# Altium project TSE_mother_board.PrjPcb
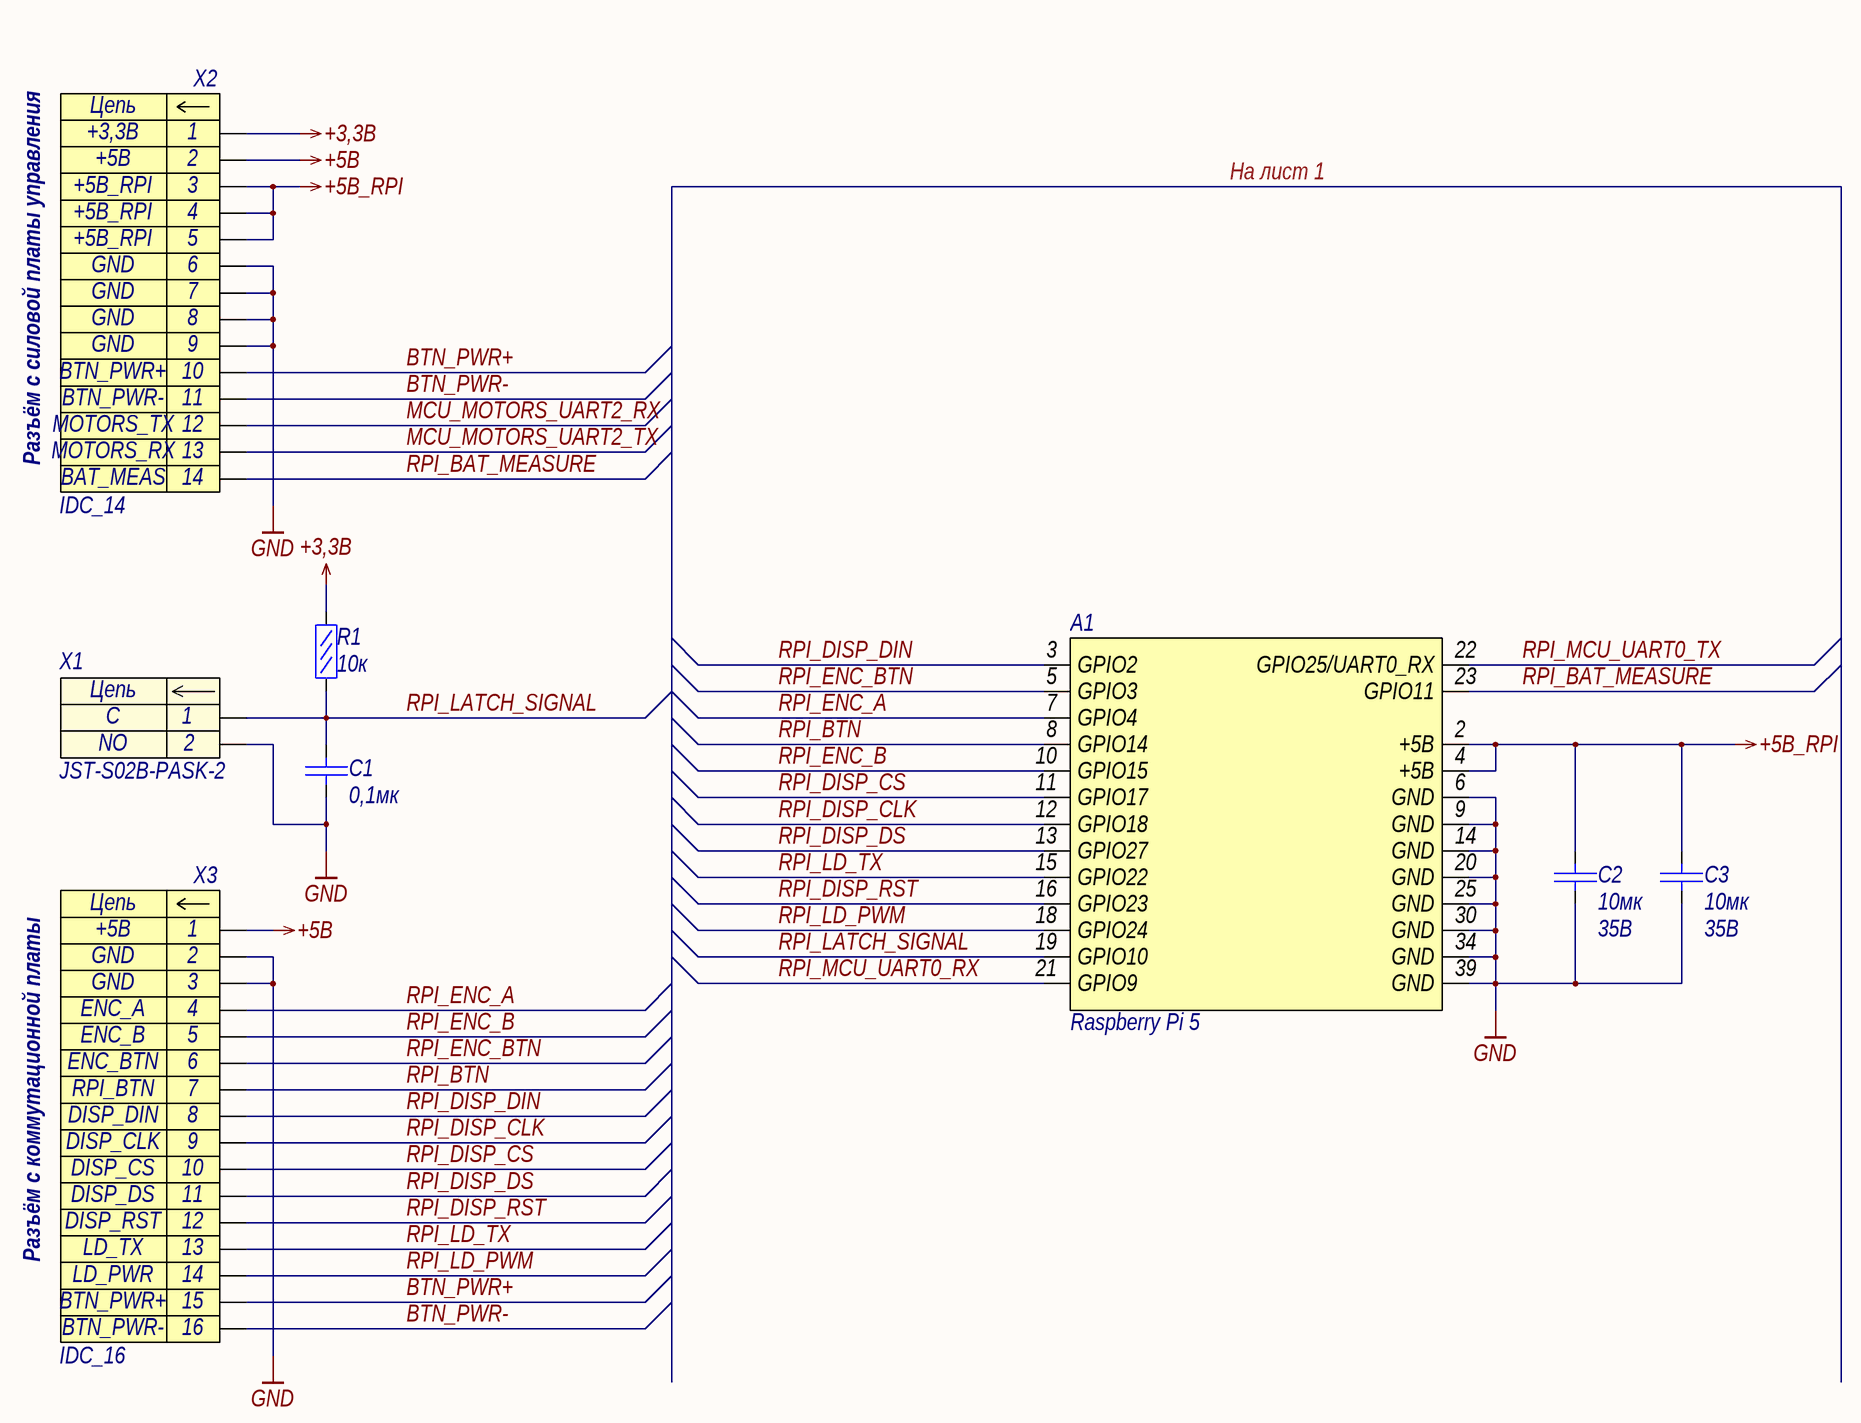
[diagram p0: TSE_mother_board_CPU_commutation.SchDoc]
3 sheets, 27 parts. Net scope: global (net labels, ports and power ports of the same name join across sheets).
Board file: TSE_mother_board.PcbDoc
Sheets:
  TSE_mother_board_CPU_commutation.SchDoc
  TSE_mother_board_MCU.SchDoc
  TSE_mother_board_periph_commutation.SchDoc

## Sheet TSE_mother_board_CPU_commutation.SchDoc
size 594 x 420 mm; SheetNumber: 1; SheetTotal: 3

### Parts
A1  Raspberry Pi 5  [PLS_40]
C1  0,1мк  [C0603]
C2  Voltage: 35В  [C1210]  (hidden comment: 10мк)
C3  Voltage: 35В  [C1210]  (hidden comment: 10мк)
R1  10к  [R0603]
X1  JST-S02B-PASK-2  [JST-S02B-PASK-2]
X2  IDC_14  [IDC1.27_14]
X3  IDC_16  [IDC1.27_16]

### Nets
+3,3В: R1.2 X2.1
+5В: X2.2 X3.1
+5В_RPI: A1.2(+5В) A1.4(+5В) C2.2 C3.2 X2.3 X2.4 X2.5
GND: A1.6(GND) A1.9(GND) A1.14(GND) A1.20(GND) A1.25(GND) A1.30(GND) A1.34(GND) A1.39(GND) C1.1 C2.1 C3.1 X1.2 X2.6 X2.7 X2.8 X2.9 X3.2 X3.3
BTN_PWR+: X2.10 X3.15
BTN_PWR-: X2.11 X3.16
MCU_MOTORS_UART2_RX: X2.12
MCU_MOTORS_UART2_TX: X2.13
RPI_BAT_MEASURE: A1.23(GPIO11) X2.14
RPI_BTN: A1.8(GPIO14) X3.7
RPI_DISP_CLK: A1.12(GPIO18) X3.9
RPI_DISP_CS: A1.11(GPIO17) X3.10
RPI_DISP_DIN: A1.3(GPIO2) X3.8
RPI_DISP_DS: A1.13(GPIO27) X3.11
RPI_DISP_RST: A1.16(GPIO23) X3.12
RPI_ENC_A: A1.7(GPIO4) X3.4
RPI_ENC_B: A1.10(GPIO15) X3.5
RPI_ENC_BTN: A1.5(GPIO3) X3.6
RPI_LATCH_SIGNAL: A1.19(GPIO10) C1.2 R1.1 X1.1
RPI_LD_PWM: A1.18(GPIO24) X3.14
RPI_LD_TX: A1.15(GPIO22) X3.13
RPI_MCU_UART0_RX: A1.21(GPIO9)
RPI_MCU_UART0_TX: A1.22(GPIO25/UART0_RX)

### Notes on the sheet
- На лист 1
- Разъём с силовой платы управления
- Разъём с коммутационной платы
- Перв. примен.
- Справ. №
- Подп. и дата
- Инв. № дубл.
- Взам. инв. №
- Изм.
- Лист
- № докум.
- Подп.
- Дата
- Лит.
- Масса
- Масштаб
- Т.контр.
- Пров.
- Разраб.
- Листов
- Инв. № подл.
- Н.контр.
- Файл:
- Утв.
- Копировал
- Формат
- (in symbol IDC_14) Цепь
- (in symbol IDC_16) Цепь
- (in symbol JST-S02B-PASK-2) Цепь

### Library data of the parts
A1 = Raspberry Pi 5: Микрокомпьютер; Наименование: Raspberry Pi 5
C1 = CC0603JPX7R9BB104: Конденсатор кер. 0,1мкФ 50В; Manufacturer: Yageo; TKE: X7R; Name: CC0603JPX7R9BB104; Value: 0,1мк
C2 C3 = CL32A106KATLNNE: Конденсатор кер. 10мкФ 35В; Manufacturer: Yageo; Name: CC1206KKX7R8BB106; TKE: X7R; Value: 10мк
R1 = RC0603FR-0710KL: Резистор 10кОм 0,063Вт 1%; Manufacturer: YAGEO; Name: RC0603FR-0710KL; Tolerance: 1%; Value: 10к
X1 = JST-S02B-PASK-2: Разъем - 2 конт. угловая вилка на плату, шаг 2,00 мм; Contact_1: C; Contact_2: NO; Наименование: JST-S02B-PASK-2
X2 = IDC_14: Разъем - 14 конт. прямая вилка на плату; Contact_1: +3,3В; Contact_2: +5В; Contact_3: +5В_RPI; Contact_6: GND; Contact_10: BTN_PWR+; Contact_11: BTN_PWR-; Contact_12: MOTORS_TX; Contact_13: MOTORS_RX; Contact_14: BAT_MEAS; Наименование: IDC_14; Contact_4: +5В_RPI; Contact_5: +5В_RPI; Contact_7: GND; Contact_8: GND; Contact_9: GND
X3 = IDC_16: Разъем - 16 конт. прямая вилка на плату; Contact_1: +5В; Contact_2: GND; Contact_4: ENC_A; Contact_5: ENC_B; Contact_6: ENC_BTN; Contact_7: RPI_BTN; Contact_8: DISP_DIN; Contact_9: DISP_CLK; Contact_10: DISP_CS; Contact_11: DISP_DS; Contact_12: DISP_RST; Contact_13: LD_TX; Contact_14: LD_PWR; Contact_15: BTN_PWR+; Contact_16: BTN_PWR-; Наименование: IDC_16; Contact_3: GND

## Sheet TSE_mother_board_MCU.SchDoc
size 594 x 420 mm; SheetNumber: 2; SheetTotal: 3
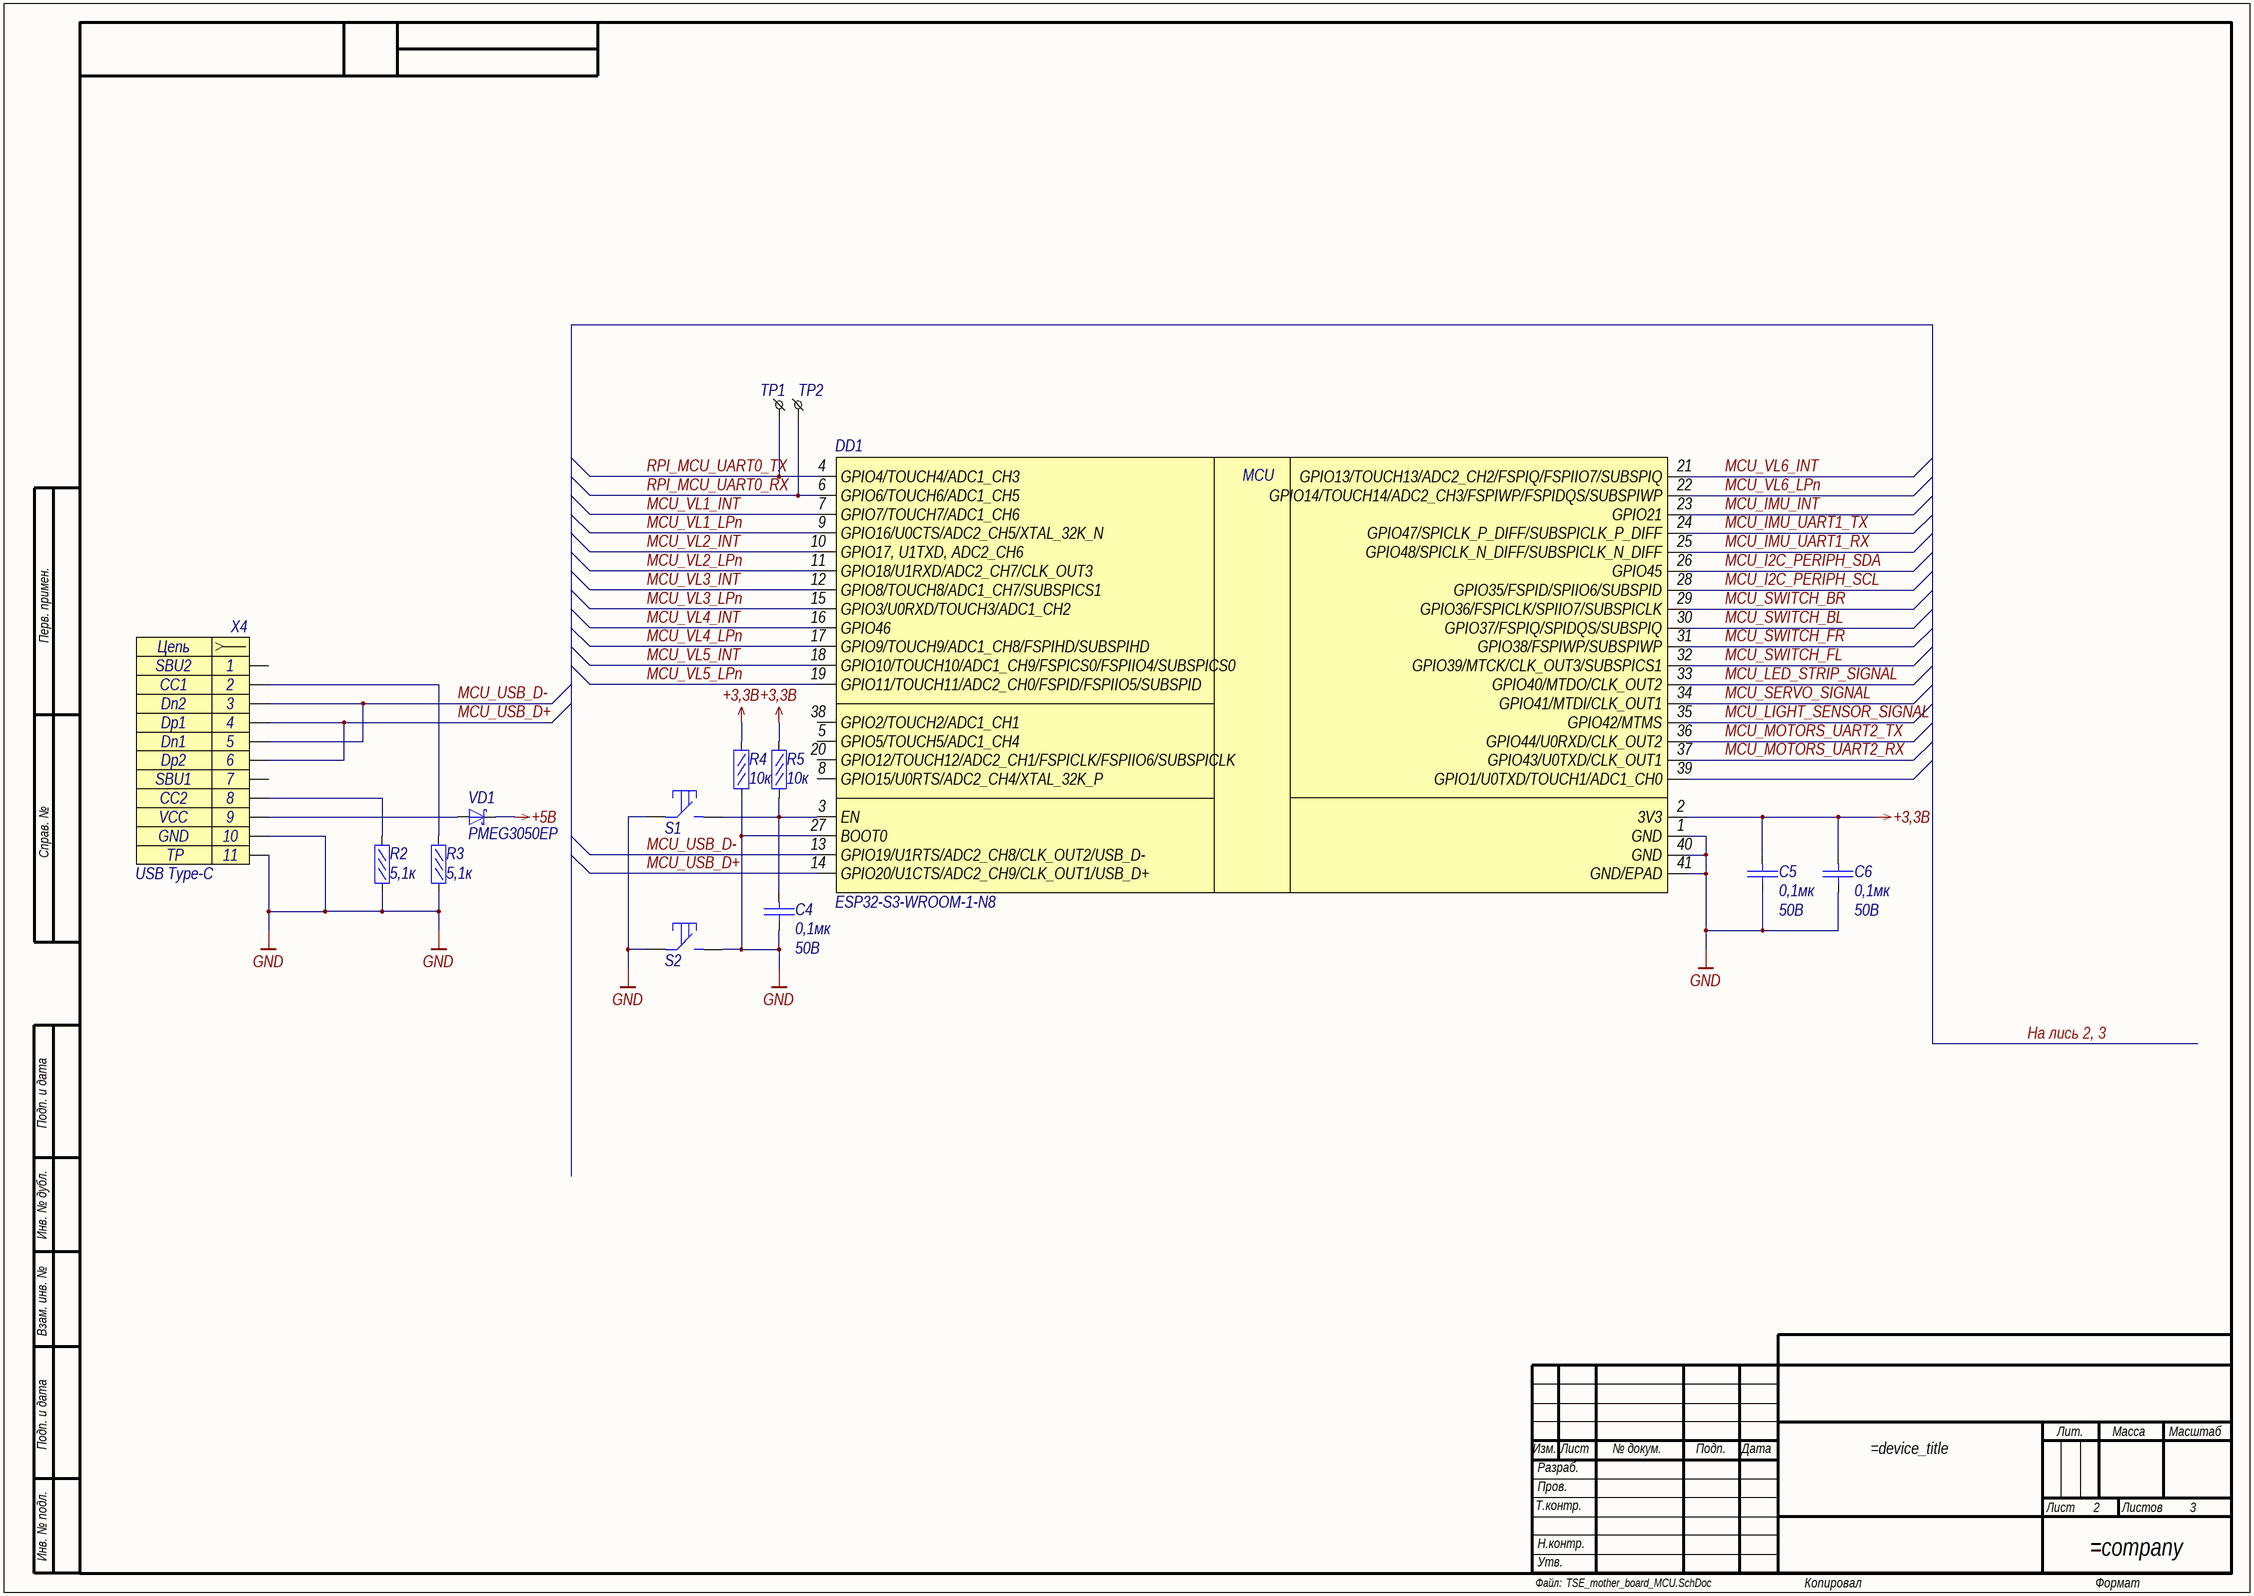
[diagram p1: TSE_mother_board_MCU.SchDoc]

### Parts
C4  Voltage: 50В  [C0603]  (hidden comment: 0,1мк)
C5  Voltage: 50В  [C0603]  (hidden comment: 0,1мк)
C6  Voltage: 50В  [C0603]  (hidden comment: 0,1мк)
DD1  ESP32-S3-WROOM-1-N8  [ESP32-S3-WROOM-1]
R2  5,1к  [R0603]
R3  5,1к  [R0603]
R4  10к  [R0603]
R5  10к  [R0603]
S1  IT-1187  [SMD button 6x3mm]  (value not drawn)
S2  IT-1187  [SMD button 6x3mm]  (value not drawn)
TP1  TESTPOINT  [TP_0,6X1]  (value not drawn)  (no BOM)
TP2  TESTPOINT  [TP_0,6X1]  (value not drawn)  (no BOM)
VD1  PMEG3050EP  [SOD128]
X4  USB Type-C  [USB4105-15-A-120]

### Nets
+3,3В: C5.2 C6.2 DD1.2(3V3) R4.2 R5.2
+5В: VD1.1(K)
GND: C4.1 C5.1 C6.1 DD1.1(GND) DD1.27(BOOT0) DD1.40(GND) DD1.41(GND/EPAD) R2.1 R3.1 R4.1 S1.1 S2.1 S2.2 X4.10(VCC) X4.TP
MCU_I2C_PERIPH_SCL: DD1.28(GPIO35/FSPID/SPIIO6/SUBSPID)
MCU_I2C_PERIPH_SDA: DD1.26(GPIO45)
MCU_IMU_INT: DD1.23(GPIO21)
MCU_IMU_UART1_RX: DD1.25(GPIO48/SPICLK_N_DIFF/SUBSPICLK_N_DIFF)
MCU_IMU_UART1_TX: DD1.24(GPIO47/SPICLK_P_DIFF/SUBSPICLK_P_DIFF)
MCU_LED_STRIP_SIGNAL: DD1.33(GPIO40/MTDO/CLK_OUT2)
MCU_LIGHT_SENSOR_SIGNAL: DD1.35(GPIO42/MTMS)
MCU_MOTORS_UART2_RX: DD1.37(GPIO43/U0TXD/CLK_OUT1)
MCU_MOTORS_UART2_TX: DD1.36(GPIO44/U0RXD/CLK_OUT2)
MCU_SERVO_SIGNAL: DD1.34(GPIO41/MTDI/CLK_OUT1)
MCU_SWITCH_BL: DD1.30(GPIO37/FSPIQ/SPIDQS/SUBSPIQ)
MCU_SWITCH_BR: DD1.29(GPIO36/FSPICLK/SPIIO7/SUBSPICLK)
MCU_SWITCH_FL: DD1.32(GPIO39/MTCK/CLK_OUT3/SUBSPICS1)
MCU_SWITCH_FR: DD1.31(GPIO38/FSPIWP/SUBSPIWP)
MCU_USB_D+: DD1.14(GPIO20/U1CTS/ADC2_CH9/CLK_OUT1/USB_D+) X4.4(A6) X4.6(B6)
MCU_USB_D-: DD1.13(GPIO19/U1RTS/ADC2_CH8/CLK_OUT2/USB_D-) X4.3(B7) X4.5(A7)
MCU_VL1_INT: DD1.7(GPIO7/TOUCH7/ADC1_CH6)
MCU_VL1_LPn: DD1.9(GPIO16/U0CTS/ADC2_CH5/XTAL_32K_N)
MCU_VL2_INT: DD1.10(GPIO17,_U1TXD,_ADC2_CH6)
MCU_VL2_LPn: DD1.11(GPIO18/U1RXD/ADC2_CH7/CLK_OUT3)
MCU_VL3_INT: DD1.12(GPIO8/TOUCH8/ADC1_CH7/SUBSPICS1)
MCU_VL3_LPn: DD1.15(GPIO3/U0RXD/TOUCH3/ADC1_CH2)
MCU_VL4_INT: DD1.16(GPIO46)
MCU_VL4_LPn: DD1.17(GPIO9/TOUCH9/ADC1_CH8/FSPIHD/SUBSPIHD)
MCU_VL5_INT: DD1.18(GPIO10/TOUCH10/ADC1_CH9/FSPICS0/FSPIIO4/SUBSPICS0)
MCU_VL5_LPn: DD1.19(GPIO11/TOUCH11/ADC2_CH0/FSPID/FSPIIO5/SUBSPID)
MCU_VL6_INT: DD1.21(GPIO13/TOUCH13/ADC2_CH2/FSPIQ/FSPIIO7/SUBSPIQ)
MCU_VL6_LPn: DD1.22(GPIO14/TOUCH14/ADC2_CH3/FSPIWP/FSPIDQS/SUBSPIWP)
RPI_MCU_UART0_RX: DD1.6(GPIO6/TOUCH6/ADC1_CH5) TP2.1
RPI_MCU_UART0_TX: DD1.4(GPIO4/TOUCH4/ADC1_CH3) TP1.1
NetC4_2: C4.2 DD1.3(EN) R5.1 S1.2
NetR2_2: R2.2 X4.8(B5)
NetR3_2: R3.2 X4.2(A5)
NetVD1_2: VD1.2(A) X4.9(GND)

Not connected (* = marked no-connect by the designer): DD1 5(GPIO5/TOUCH5/ADC1_CH4) 8(GPIO15/U0RTS/ADC2_CH4/XTAL_32K_P) 20(GPIO12/TOUCH12/ADC2_CH1/FSPICLK/FSPIIO6/SUBSPICLK) 38(GPIO2/TOUCH2/ADC1_CH1) 39(GPIO1/U0TXD/TOUCH1/ADC1_CH0); X4 1(B8) 7(A8)

### Notes on the sheet
- На лись 2, 3
- Перв. примен.
- Справ. №
- Подп. и дата
- Инв. № дубл.
- Взам. инв. №
- Изм.
- Лист
- № докум.
- Подп.
- Дата
- Лит.
- Масса
- Масштаб
- Т.контр.
- Пров.
- Разраб.
- Листов
- Инв. № подл.
- Н.контр.
- Файл:
- Утв.
- Копировал
- Формат
- (in symbol ESP32-S3-WROOM-1-N8) MCU
- (in symbol USB4105-15-A-120) Цепь; 11

### Library data of the parts
C4-C6 = CC0603JPX7R9BB104: as C1 on sheet TSE_mother_board_CPU_commutation; Name: CC0603JPX7R9BB104; Value: 0,1мк
DD1 = ESP32-S3-WROOM-1-N8: Микроконтроллер; Наименование: ESP32-S3-WROOM-1-N8
R2 R3 = RC0603FR-075K1L: Резистор 5,1кОм 0,1Вт 1%; Manufacturer: YAGEO; Name: RC0603FR-075K1L; Tolerance: 1%; Value: 5,1к
R4 R5 = RC0603FR-0710KL: as R1 on sheet TSE_mother_board_CPU_commutation; Name: RC0603FR-0710KL; Tolerance: 1%; Value: 10к
S1 S2 = button: тактовая кнопка SMD; Name: IT-1187
TP1 TP2 = TESTPOINT_HOLE: Name: TESTPOINT
VD1 = PMEG3050EP_1: Диод Шоттки 30В 5А; Manufacturer: NXP; Name: PMEG3050EP
X4 = USB4105-15-A-120: USB Type-C USB4105-GF-A / GCT; Contact_1: SBU2; Contact_2: CC1; Contact_3: Dn2; Contact_4: Dp1; Contact_5: Dn1; Contact_6: Dp2; Contact_7: SBU1; Contact_8: CC2; Contact_9: VCC; Contact_10: GND; Name: USB Type-C

## Sheet TSE_mother_board_periph_commutation.SchDoc
size 594 x 420 mm; SheetNumber: 3; SheetTotal: 3
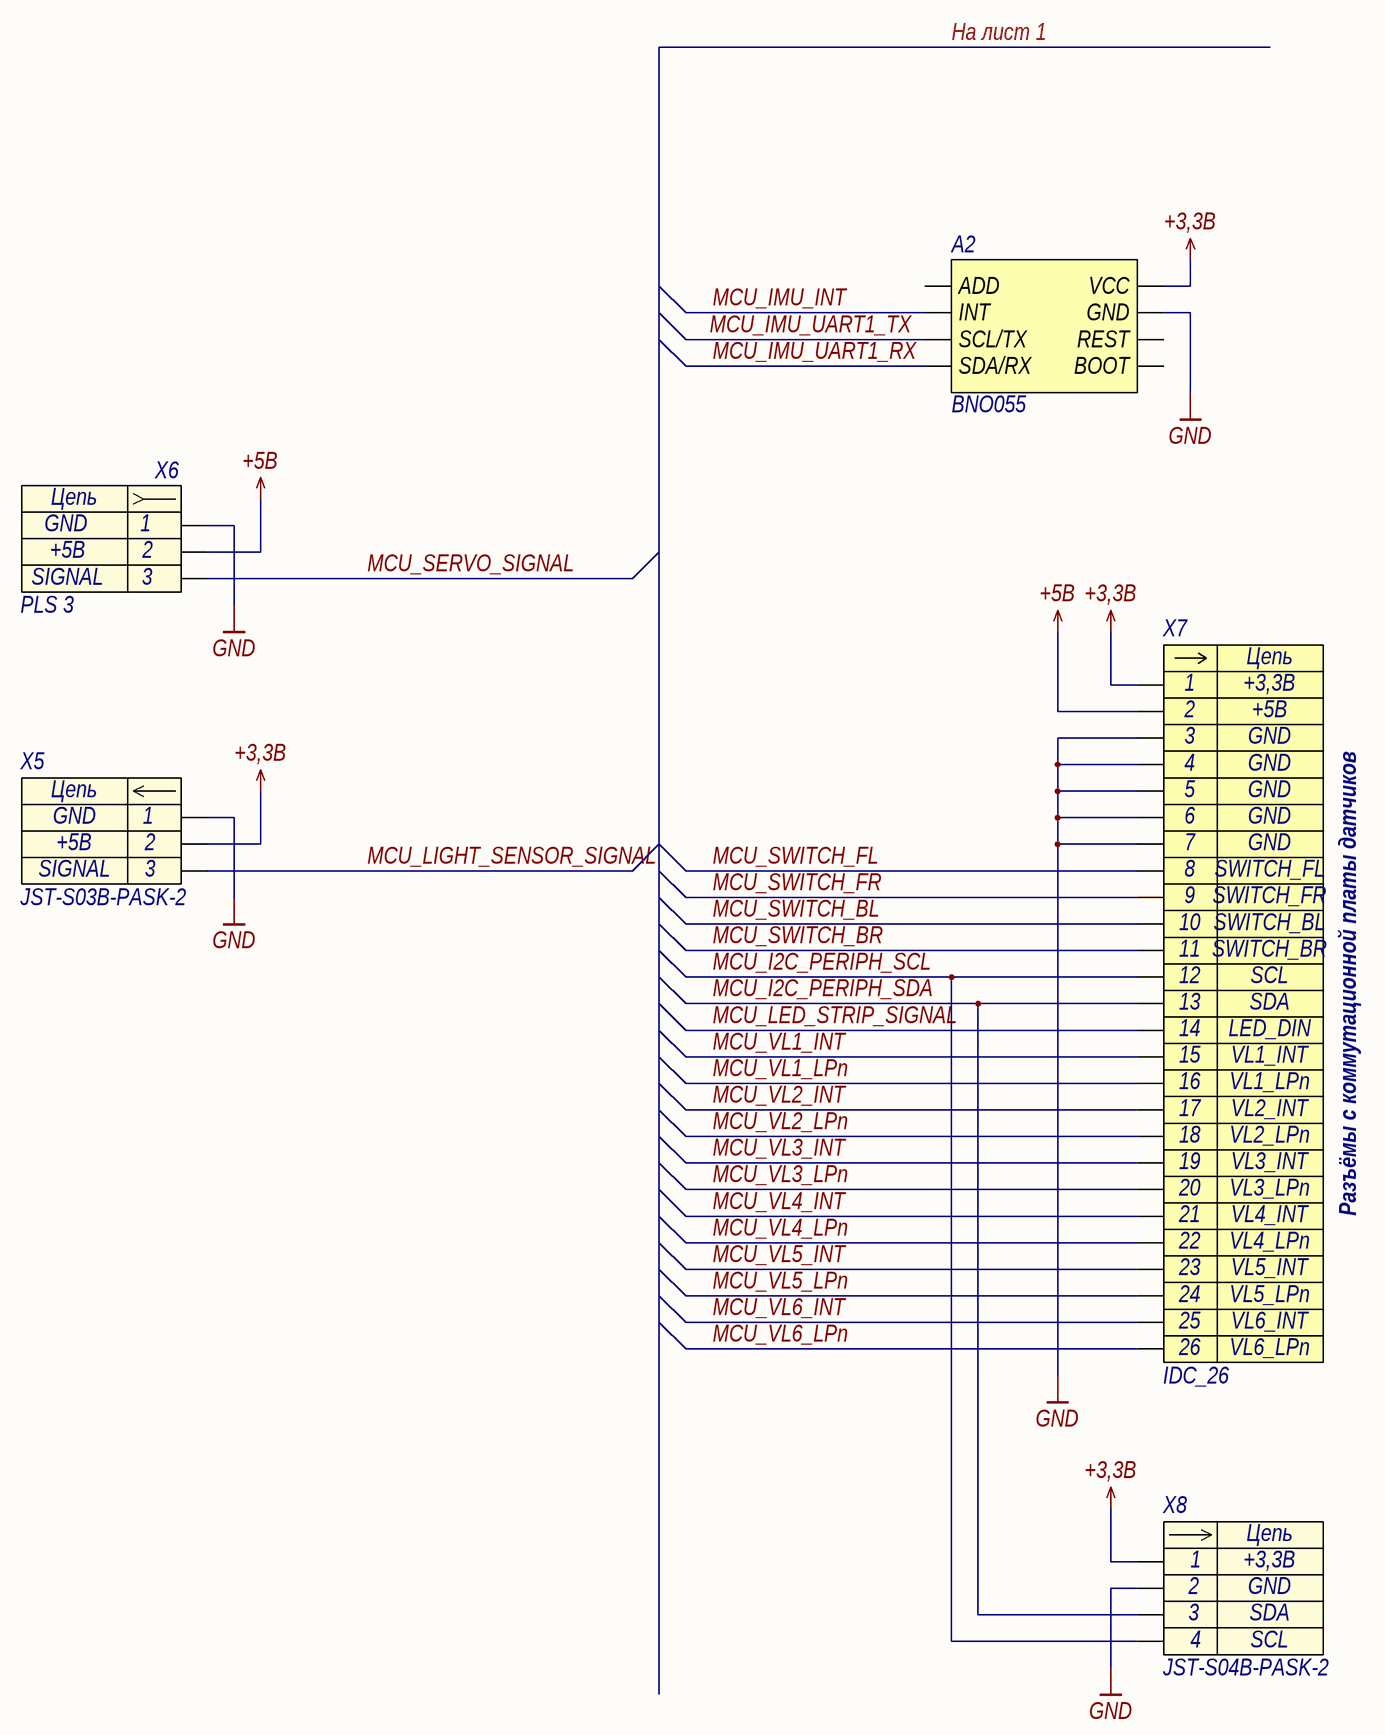
[diagram p2: TSE_mother_board_periph_commutation.SchDoc]

### Parts
A2  BNO055  [BNO055]
X5  JST-S03B-PASK-2  [JST-S03B-PASK-2]
X6  PLS 3  [pls-2,54-3-tht-v]
X7  IDC_26  [IDC1.27_26]
X8  JST-S04B-PASK-2  [JST-S04B-PASK-2]

### Nets
+3,3В: A2.1(VCC) X5.2 X7.1 X8.1
+5В: X6.2 X7.2
GND: A2.2(GND) X5.1 X6.1 X7.3 X7.4 X7.5 X7.6 X7.7 X8.2
MCU_I2C_PERIPH_SCL: X7.12 X8.4
MCU_I2C_PERIPH_SDA: X7.13 X8.3
MCU_IMU_INT: A2.6(INT)
MCU_IMU_UART1_RX: A2.3(SDA/RX)
MCU_IMU_UART1_TX: A2.4(SCL/TX)
MCU_LED_STRIP_SIGNAL: X7.14
MCU_LIGHT_SENSOR_SIGNAL: X5.3
MCU_SERVO_SIGNAL: X6.3
MCU_SWITCH_BL: X7.10
MCU_SWITCH_BR: X7.11
MCU_SWITCH_FL: X7.8
MCU_SWITCH_FR: X7.9
MCU_VL1_INT: X7.15
MCU_VL1_LPn: X7.16
MCU_VL2_INT: X7.17
MCU_VL2_LPn: X7.18
MCU_VL3_INT: X7.19
MCU_VL3_LPn: X7.20
MCU_VL4_INT: X7.21
MCU_VL4_LPn: X7.22
MCU_VL5_INT: X7.23
MCU_VL5_LPn: X7.24
MCU_VL6_INT: X7.25
MCU_VL6_LPn: X7.26

Not connected (* = marked no-connect by the designer): A2 5(ADD) 7(BOOT) 8(REST)

### Notes on the sheet
- На лист 1
- Разъёмы с коммутационной платы датчиков
- Подп. и дата
- Инв. № дубл.
- Взам. инв. №
- Инв. № подл.
- Лист
- Файл:
- Изм.
- № докум.
- Подп.
- Дата
- Копировал
- Формат
- (in symbol IDC_26) Цепь
- (in symbol JST-S03B-PASK-2) Цепь
- (in symbol JST-S04B-PASK-2) Цепь
- (in symbol PLS-3 ICSP_1) Цепь

### Library data of the parts
A2 = BNO055: 9-осевой гироскоп и акселерометр; Наименование: BNO055
X5 = JST-S03B-PASK-2: Разъем - 3 конт. угловая вилка на плату, шаг 2,00 мм; Contact_1: GND; Contact_2: +5В; Contact_3: SIGNAL; Наименование: JST-S03B-PASK-2
X6 = PLS-3 ICSP_1: Разъем - 6 конт. 3, шаг 2,54 мм; Contact_1: GND; Contact_2: +5В; Contact_3: SIGNAL; Name: PLS 3
X7 = IDC_26: Разъем - 26 конт. прямая вилка на плату; Contact_1: +3,3В; Contact_2: +5В; Contact_3: GND; Contact_8: SWITCH_FL; Contact_9: SWITCH_FR; Contact_10: SWITCH_BL; Contact_11: SWITCH_BR; Contact_12: SCL; Contact_13: SDA; Contact_14: LED_DIN; Contact_15: VL1_INT; Contact_16: VL1_LPn; Contact_17: VL2_INT; Contact_18: VL2_LPn; Contact_19: VL3_INT; Contact_20: VL3_LPn; Contact_21: VL4_INT; Contact_22: VL4_LPn; Contact_23: VL5_INT; Contact_24: VL5_LPn; Contact_25: VL6_INT; Contact_26: VL6_LPn; Наименование: IDC_26; Contact_4: GND; Contact_5: GND; Contact_6: GND; Contact_7: GND
X8 = JST-S04B-PASK-2: Разъем - 4 конт. угловая вилка на плату, шаг 2,00 мм; Contact_1: +3,3В; Contact_2: GND; Contact_3: SDA; Contact_4: SCL; Наименование: JST-S04B-PASK-2

## Nets that join several sheets
+3,3В: TSE_mother_board_CPU_commutation (R1.2 X2.1), TSE_mother_board_MCU (5 pins), TSE_mother_board_periph_commutation (A2.1 X5.2 X7.1 X8.1)
+5В: TSE_mother_board_CPU_commutation (X2.2 X3.1), TSE_mother_board_MCU (VD1.1), TSE_mother_board_periph_commutation (X6.2 X7.2)
GND: TSE_mother_board_CPU_commutation (18 pins), TSE_mother_board_MCU (15 pins), TSE_mother_board_periph_commutation (9 pins)
MCU_I2C_PERIPH_SCL: TSE_mother_board_MCU (DD1.28), TSE_mother_board_periph_commutation (X7.12 X8.4)
MCU_I2C_PERIPH_SDA: TSE_mother_board_MCU (DD1.26), TSE_mother_board_periph_commutation (X7.13 X8.3)
MCU_IMU_INT: TSE_mother_board_MCU (DD1.23), TSE_mother_board_periph_commutation (A2.6)
MCU_IMU_UART1_RX: TSE_mother_board_MCU (DD1.25), TSE_mother_board_periph_commutation (A2.3)
MCU_IMU_UART1_TX: TSE_mother_board_MCU (DD1.24), TSE_mother_board_periph_commutation (A2.4)
MCU_LED_STRIP_SIGNAL: TSE_mother_board_MCU (DD1.33), TSE_mother_board_periph_commutation (X7.14)
MCU_LIGHT_SENSOR_SIGNAL: TSE_mother_board_MCU (DD1.35), TSE_mother_board_periph_commutation (X5.3)
MCU_MOTORS_UART2_RX: TSE_mother_board_CPU_commutation (X2.12), TSE_mother_board_MCU (DD1.37)
MCU_MOTORS_UART2_TX: TSE_mother_board_CPU_commutation (X2.13), TSE_mother_board_MCU (DD1.36)
MCU_SERVO_SIGNAL: TSE_mother_board_MCU (DD1.34), TSE_mother_board_periph_commutation (X6.3)
MCU_SWITCH_BL: TSE_mother_board_MCU (DD1.30), TSE_mother_board_periph_commutation (X7.10)
MCU_SWITCH_BR: TSE_mother_board_MCU (DD1.29), TSE_mother_board_periph_commutation (X7.11)
MCU_SWITCH_FL: TSE_mother_board_MCU (DD1.32), TSE_mother_board_periph_commutation (X7.8)
MCU_SWITCH_FR: TSE_mother_board_MCU (DD1.31), TSE_mother_board_periph_commutation (X7.9)
MCU_VL1_INT: TSE_mother_board_MCU (DD1.7), TSE_mother_board_periph_commutation (X7.15)
MCU_VL1_LPn: TSE_mother_board_MCU (DD1.9), TSE_mother_board_periph_commutation (X7.16)
MCU_VL2_INT: TSE_mother_board_MCU (DD1.10), TSE_mother_board_periph_commutation (X7.17)
MCU_VL2_LPn: TSE_mother_board_MCU (DD1.11), TSE_mother_board_periph_commutation (X7.18)
MCU_VL3_INT: TSE_mother_board_MCU (DD1.12), TSE_mother_board_periph_commutation (X7.19)
MCU_VL3_LPn: TSE_mother_board_MCU (DD1.15), TSE_mother_board_periph_commutation (X7.20)
MCU_VL4_INT: TSE_mother_board_MCU (DD1.16), TSE_mother_board_periph_commutation (X7.21)
MCU_VL4_LPn: TSE_mother_board_MCU (DD1.17), TSE_mother_board_periph_commutation (X7.22)
MCU_VL5_INT: TSE_mother_board_MCU (DD1.18), TSE_mother_board_periph_commutation (X7.23)
MCU_VL5_LPn: TSE_mother_board_MCU (DD1.19), TSE_mother_board_periph_commutation (X7.24)
MCU_VL6_INT: TSE_mother_board_MCU (DD1.21), TSE_mother_board_periph_commutation (X7.25)
MCU_VL6_LPn: TSE_mother_board_MCU (DD1.22), TSE_mother_board_periph_commutation (X7.26)
RPI_MCU_UART0_RX: TSE_mother_board_CPU_commutation (A1.21), TSE_mother_board_MCU (DD1.6 TP2.1)
RPI_MCU_UART0_TX: TSE_mother_board_CPU_commutation (A1.22), TSE_mother_board_MCU (DD1.4 TP1.1)